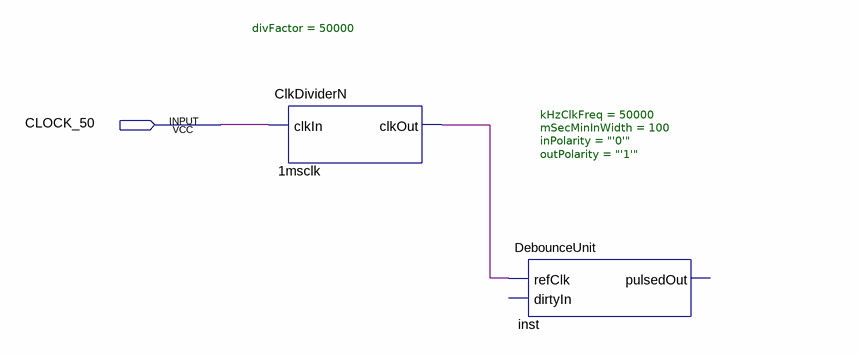
[diagram p0: schematic sheet]
// Quartus schematic ReactionTimer.bdf as structural Verilog: 2 symbols, 1 pins
module ReactionTimer (
  input  CLOCK_50
);

  wire n1msclk_clkout;

  ClkDividerN #(.divFactor(50000)) u_1msclk (.clkIn(CLOCK_50), .clkOut(n1msclk_clkout));
  DebounceUnit #(.kHzClkFreq(50000), .mSecMinInWidth(100), .inPolarity("'0'"), .outPolarity("'1'")) inst (.refClk(n1msclk_clkout));  // open: dirtyIn, pulsedOut
endmodule
